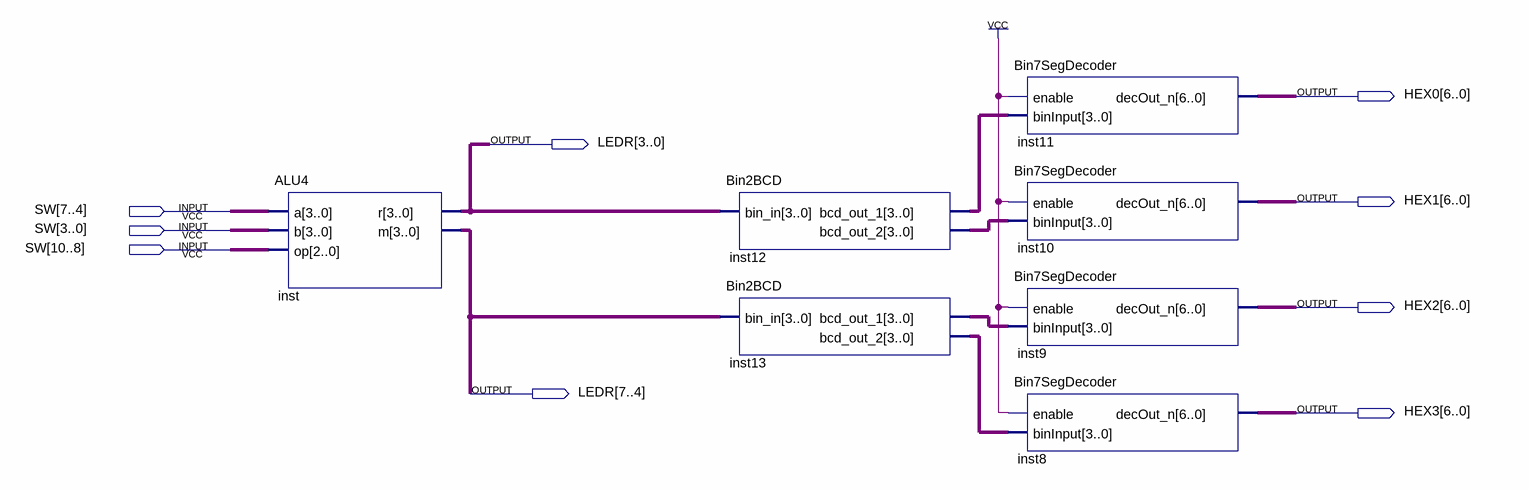
[diagram p0: schematic sheet]
// Quartus schematic ALUDemo.bdf as structural Verilog: 7 symbols, 9 pins
module ALUDemo (
  input  [10:0] SW,
  output [6:0] HEX0,
  output [7:0] LEDR,
  output [6:0] HEX1,
  output [6:0] HEX2,
  output [6:0] HEX3
);

  wire [3:0] inst12_bcd_out_1, inst12_bcd_out_2, inst13_bcd_out_1, inst13_bcd_out_2;

  ALU4 inst (.a(SW[7:4]), .b(SW[3:0]), .op(SW[10:8]), .r(LEDR[3:0]), .m(LEDR[7:4]));
  Bin2BCD inst12 (.bin_in(LEDR[3:0]), .bcd_out_1(inst12_bcd_out_1), .bcd_out_2(inst12_bcd_out_2));
  Bin2BCD inst13 (.bin_in(LEDR[7:4]), .bcd_out_1(inst13_bcd_out_1), .bcd_out_2(inst13_bcd_out_2));
  Bin7SegDecoder inst11 (.enable(1'b1), .binInput(inst12_bcd_out_1), .decOut_n(HEX0));
  Bin7SegDecoder inst10 (.enable(1'b1), .binInput(inst12_bcd_out_2), .decOut_n(HEX1));
  Bin7SegDecoder inst9 (.enable(1'b1), .binInput(inst13_bcd_out_1), .decOut_n(HEX2));
  Bin7SegDecoder inst8 (.enable(1'b1), .binInput(inst13_bcd_out_2), .decOut_n(HEX3));
endmodule
